# Altium schematic sheet interface.SchDoc: User Interface
size 148 x 209 mm; Revision: 1.0.0; SheetNumber: 9; SheetTotal: 10
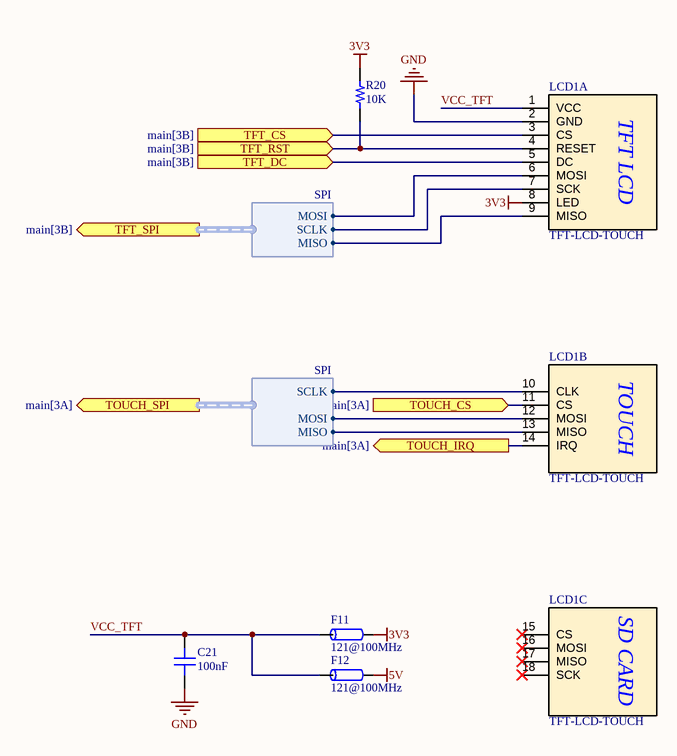
[diagram p0: interface.SchDoc]

## Parts
C21  100nF  [CAP 0603_1608]
F11  121@100MHz  [Ferrite-0805]
F12  121@100MHz  [Ferrite-0805]
LCD1  TFT-LCD-TOUCH  [TFT-2.8"-NO-SCREWS]  (parts A,B,C of 3)
R20  10K  [RES 0603_1608]

## Ports
TFT_CS (in, see main[3B]), TFT_DC (in, see main[3B]), TFT_RST (in, see main[3B]), TFT_SPI (out, harness SPI, see main[3B]), TOUCH_CS (in, see main[3A]), TOUCH_IRQ (out, see main[3A]), TOUCH_SPI (out, harness SPI, see main[3A])

## Harnesses
SPI: MISO, MOSI, SCLK

## Nets
3V3: F11.1 LCD1.8(LED) R20.2
5V: F12.1
GND: C21.1 LCD1.2(GND)
TFT_CS: LCD1.3(CS) ; port TFT_CS
TFT_DC: LCD1.5(DC) ; port TFT_DC
TFT_RST: LCD1.4(RESET) R20.1 ; port TFT_RST
TOUCH_CS: LCD1.11(CS) ; port TOUCH_CS
TOUCH_IRQ: LCD1.14(IRQ) ; port TOUCH_IRQ
VCC_TFT: C21.2 F11.2 F12.2 LCD1.1(VCC)
NetLCD1_6: LCD1.6(MOSI) ; port TFT_SPI.MOSI
NetLCD1_7: LCD1.7(SCK) ; port TFT_SPI.SCLK
NetLCD1_9: LCD1.9(MISO) ; port TFT_SPI.MISO
NetLCD1_10: LCD1.10(CLK) ; port TOUCH_SPI.SCLK
NetLCD1_12: LCD1.12(MOSI) ; port TOUCH_SPI.MOSI
NetLCD1_13: LCD1.13(MISO) ; port TOUCH_SPI.MISO

Not connected (* = marked no-connect by the designer): LCD1 15(CS)* 16(MOSI)* 17(MISO)* 18(SCK)*

## Notes on the sheet
- TITLE
- DESIGNER
- PRODUCT NUMBER
- SHEET VERSION
- SHEET
- OF
- LAST MODIFIED
- (in symbol TFT-LCD-TOUCH, part A) TFT LCD
- (in symbol TFT-LCD-TOUCH, part B) TOUCH
- (in symbol TFT-LCD-TOUCH, part C) SD CARD

## Library data of the parts
C21 = Cap 0603: SMT Capacitor; VALUE: 100nF
F11 F12 = Ferrite Bead
R20 = Res 0603: SMT Resistor; VALUE: 10K